# EAGLE design Team 1 board (EAGLE 9.6.2)
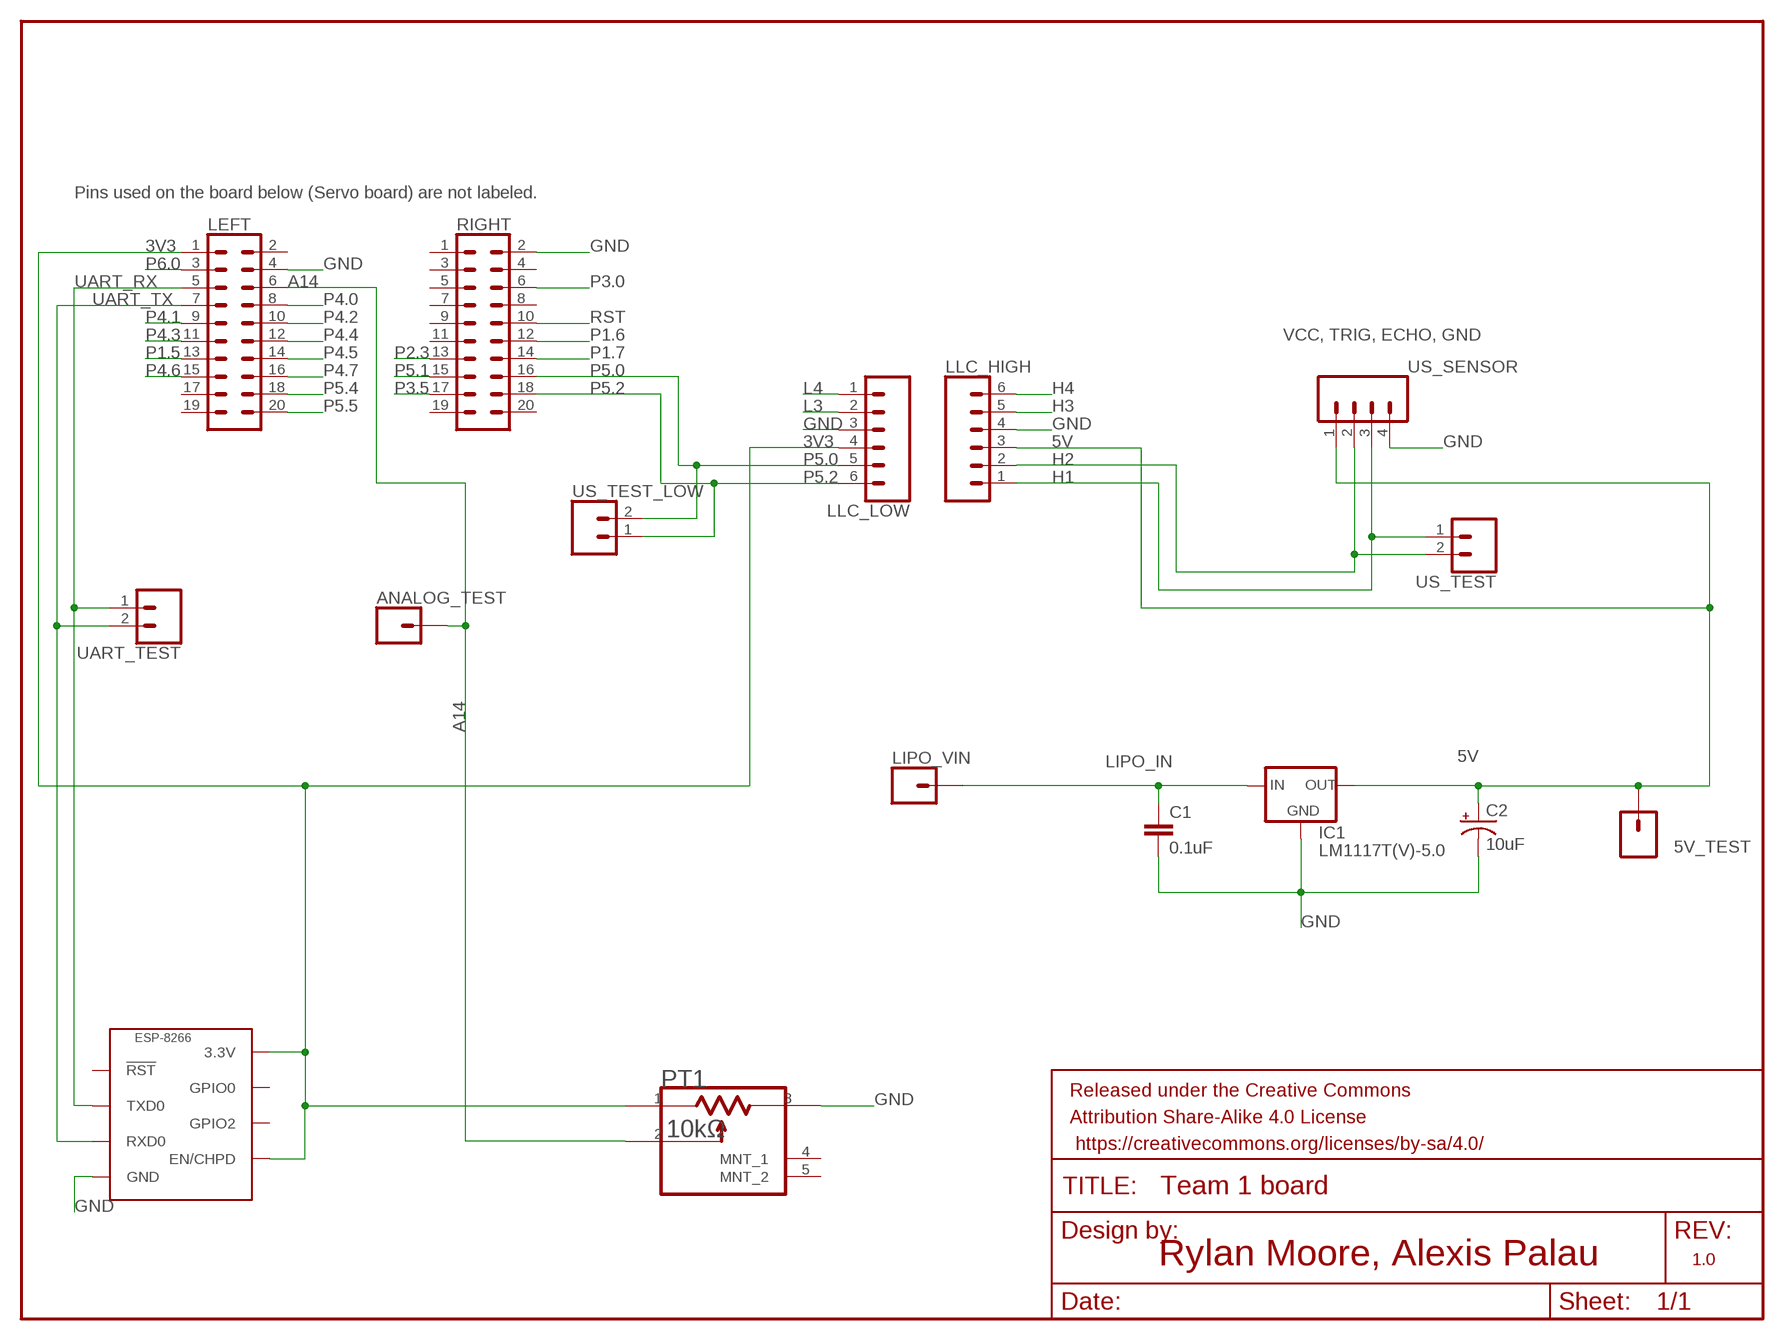
[diagram p0: schematic, sheet 1]

## Parts
5V_TEST  CONN_01  [1X01]
ANALOG_TEST  CONN_01  [1X01]
C1  0.1uF  0.1UF-KIT-EZ-50V-20%  [CAP-PTH-SMALL-KIT]
C2  10uF  10UF-POLAR-RADIAL-2.5MM-25V-20%  [CPOL-RADIAL-2.5MM-5MM]
ESP-8266  ESP8266_ESP-01  [ESP8266_ESP-01_NO-SILKSCREEN]
FRAME1  FRAME-LETTERNO_PACKAGE  [DUMMY]
IC1  LM1117T(V)-5.0  [TO220V]
LEFT  CONN_10X2NOSILK  [2X10_NOSILK]
LIPO_VIN  CONN_01  [1X01]
LLC_HIGH  CONN_06SILK_FEMALE_PTH  [1X06]
LLC_LOW  CONN_06SILK_FEMALE_PTH  [1X06]
PT1  ECG_EVU-F2AF30B14ECG_EVU-F2AF30B14_0_0  [ECG_EVU-F2AF30B14_0]
RIGHT  CONN_10X2NOSILK  [2X10_NOSILK]
UART_TEST  CONN_02  [1X02]
US_SENSOR  CONN_04  [1X04]
US_TEST  CONN_02  [1X02]
US_TEST_LOW  CONN_02  [1X02]

## Nets
3V3: ESP-8266.3V3(3.3V) ESP-8266.EN/CH_PD(EN/CHPD) LEFT.1 LLC_LOW.4 PT1.1
5V: 5V_TEST.1 C2.1(+) IC1.2(OUT) LLC_HIGH.3 US_SENSOR.1
A14: ANALOG_TEST.1 LEFT.6 PT1.2
GND: C1.2 C2.2(-) ESP-8266.GND IC1.1(GND) LEFT.4 LLC_HIGH.4 LLC_LOW.3 PT1.3 RIGHT.2 US_SENSOR.4
H1: LLC_HIGH.1 US_SENSOR.3 US_TEST.1
H2: LLC_HIGH.2 US_SENSOR.2 US_TEST.2
H3: LLC_HIGH.5
H4: LLC_HIGH.6
L3: LLC_LOW.2
L4: LLC_LOW.1
LIPO_IN: C1.1 IC1.3(IN) LIPO_VIN.1
P1.5: LEFT.13
P1.6: RIGHT.12
P1.7: RIGHT.14
P2.3: RIGHT.13
P3.0: RIGHT.6
P3.5: RIGHT.17
P4.0: LEFT.8
P4.1: LEFT.9
P4.2: LEFT.10
P4.3: LEFT.11
P4.4: LEFT.12
P4.5: LEFT.14
P4.6: LEFT.15
P4.7: LEFT.16
P5.0: LLC_LOW.5 RIGHT.16 US_TEST_LOW.2
P5.1: RIGHT.15
P5.2: LLC_LOW.6 RIGHT.18 US_TEST_LOW.1
P5.4: LEFT.18
P5.5: LEFT.20
P6.0: LEFT.3
RST: RIGHT.10
UART_RX: ESP-8266.TX(TXD0) LEFT.5 UART_TEST.1
UART_TX: ESP-8266.RX(RXD0) LEFT.7 UART_TEST.2
Unconnected: ESP-8266.GPIO0 ESP-8266.GPIO2 ESP-8266.RST(!RST!) LEFT.2 LEFT.17 LEFT.19 PT1.4(MNT_1) PT1.5(MNT_2) RIGHT.1 RIGHT.3 RIGHT.4 RIGHT.5 RIGHT.7 RIGHT.8 RIGHT.9 RIGHT.11 RIGHT.19 RIGHT.20

## Notes on the sheet
- Pins used on the board below (Servo board) are not labeled.
- VCC, TRIG, ECHO, GND
- Rylan Moore, Alexis Palau | 1.0

## Library data of the parts
5V_TEST ANALOG_TEST LIPO_VIN = SparkFun-Connectors:CONN_01: Single connection point. Often used as Generic Header-pin footprint for 0.1 inch spaced/style header connections On any of the 0.1 inch spaced packages, you can populate with these: Break Away Headers - Straight <https://www.sparkfun.com/products/116> (PRT-00116) Break Away Male Headers - Right Angle <https://www.sparkfun.com/products/553> (PRT-00553) Female Headers <https://www.sparkfun.com/products/115> (PRT-00115) Break Away Headers - Machine Pin <https://www.sparkfun.com/products/117> (PRT-00117) Break Away Female Headers - Swiss Machine Pin <https://www.sparkfun.com/products/743> (PRT-00743) This device is also useful as a general connection point to wire up your design to another part of your project. Our various solder wires solder well into these plated through hole pads. Hook-Up Wire - Assortment (Stranded, 22 AWG) <https://www.sparkfun.com/products/11375> (PRT-11375) Hook-Up Wire - Assortment (Solid Core, 22 AWG) <https://www.sparkfun.com/products/11367> (PRT-11367) View the entire wire category on our website here <https://www.sparkfun.com/categories/141> Special notes: SMTSO-256-ET is a "flush mount" nut for a 4-40 screw. We mostly use this on specialty testbeds; it is a nice way to connect hardware to your PCB at an adjustable hieght. Also note, the SNAP packages are for using a snappable style connector. We sell a baggie of snaps and they are also used on two LilyPad designs: Snap Assortment - 30 pack (male and female) <https://www.sparkfun.com/products/11347> (DEV-11347) LilyPad Arduino SimpleSnap <https://www.sparkfun.com/products/10941> (DEV-10941) LilyPad SimpleSnap Protoboard <https://www.sparkfun.com/products/10940> (DEV-10940)
C1 = SparkFun-Capacitors:0.1UF: 0.1µF ceramic capacitors A capacitor is a passive two-terminal electrical component used to store electrical energy temporarily in an electric field.; PROD_ID: CAP-08370
C2 = SparkFun-Capacitors:10UF-POLAR: 10.0µF polarized capacitors A capacitor is a passive two-terminal electrical component used to store electrical energy temporarily in an electric field.; PROD_ID: CAP-08440
ESP-8266 = LuisLab-Boards:ESP8266_ESP-?
FRAME1 = SparkFun-Aesthetics:FRAME-LETTER: Schematic Frame - Letter Standard 8.5x11 US Letter frame; DESIGNER: Nobody; VERSION: v01
IC1 = lm1117_10:LM1117?-*: 800mA Low-Dropout Linear Regulator Source: http://www.ti.com/lit/ds/symlink/lm1117-n.pdf; MF: Texas Instruments; MPN: LM1117T-5.0; OC_FARNELL: 1215183; OC_NEWARK: 41K3491
LEFT RIGHT = SparkFun-Connectors:CONN_10X2: Multi connection point. Often used as Generic Header-pin footprint for 0.1 inch spaced/style header connections On any of the 0.1 inch spaced packages, you can populate with these: Break Away Headers - Straight <https://www.sparkfun.com/products/116> (PRT-00116) Break Away Male Headers - Right Angle <https://www.sparkfun.com/products/553> (PRT-00553) Female Headers <https://www.sparkfun.com/products/115> (PRT-00115) Break Away Headers - Machine Pin <https://www.sparkfun.com/products/117> (PRT-00117) Break Away Female Headers - Swiss Machine Pin <https://www.sparkfun.com/products/743> (PRT-00743) Special note about the "SPECIAL" package: This was SPECIALLY designed to be used with our Graphic LCD Backpack. Be sure you want to use this! It is not only staggered on each line of header holes, but IT IS ALSO offset of the center point of the top and bottom lines by 5 mil. This causes the headers to lock into place on the "standard" footprint on the LCD screen. The extra squares on the tdocu layer are there simply to reference other pins (if you were to actually populate a longer header than ten long - this is what we do with the backpacks).
LLC_HIGH LLC_LOW = SparkFun-Connectors:CONN_06: Multi connection point. Often used as Generic Header-pin footprint for 0.1 inch spaced/style header connections On any of the 0.1 inch spaced packages, you can populate with these: Break Away Headers - Straight <https://www.sparkfun.com/products/116> (PRT-00116) Break Away Male Headers - Right Angle <https://www.sparkfun.com/products/553> (PRT-00553) Female Headers <https://www.sparkfun.com/products/115> (PRT-00115) Break Away Headers - Machine Pin <https://www.sparkfun.com/products/117> (PRT-00117) Break Away Female Headers - Swiss Machine Pin <https://www.sparkfun.com/products/743> (PRT-00743) Arduino Stackable Header - 6 Pin <https://www.sparkfun.com/products/9280> (PRT-09280) For SCREWTERMINALS and SPRING TERMINALS visit here: Screw Terimnals on SparkFun.com <https://www.sparkfun.com/search/results?term=Screw+Terminals> (5mm/3.5mm/2.54mm spacing) This device is also useful as a general connection point to wire up your design to another part of your project. Our various solder wires solder well into these plated through hole pads. Hook-Up Wire - Assortment (Stranded, 22 AWG) <https://www.sparkfun.com/products/11375> (PRT-11375) Hook-Up Wire - Assortment (Solid Core, 22 AWG) <https://www.sparkfun.com/products/11367> (PRT-11367) View the entire wire category on our website here <https://www.sparkfun.com/categories/141>; PROD_ID: CONN-08437
PT1 = ECG - EVU-F2AF30B14:ECG_EVU-F2AF30B14: Rotary Potentiometers; CENTROID_NOT_SPECIFIED: No; DATASHEET: https://upverter.com/datasheet/ffe9b4400cd6828c9be88987894b812b9e4368d0.pdf; DIGIKEY_DESCRIPTION: RES 10k Ohm 1 Gang Linear Through Hole, Snap In Potentiometer None 1 Turn 0.05W, 1/20W PC Pins, Board Locks; DIGIKEY_PART_NUMBER: P3C3103-ND; LEAD_FREE: yes; MF: ECG; MOUSER_PART_NUMBER: 667-EVU-F2AF30B14; MPN: EVU-F2AF30B14; PACKAGE: PTH_9MM7_12MM5; PREFIX: R; RESISTANCE: 10kΩ; ROHS: yes
UART_TEST US_TEST US_TEST_LOW = SparkFun-Connectors:CONN_02: Multi connection point. Often used as Generic Header-pin footprint for 0.1 inch spaced/style header connections On any of the 0.1 inch spaced packages, you can populate with these: Break Away Headers - Straight <https://www.sparkfun.com/products/116> (PRT-00116) Break Away Male Headers - Right Angle <https://www.sparkfun.com/products/553> (PRT-00553) Female Headers <https://www.sparkfun.com/products/115> (PRT-00115) Break Away Headers - Machine Pin <https://www.sparkfun.com/products/117> (PRT-00117) Break Away Female Headers - Swiss Machine Pin <https://www.sparkfun.com/products/743> (PRT-00743) For SCREWTERMINALS and SPRING TERMINALS visit here: Screw Terimnals on SparkFun.com <https://www.sparkfun.com/search/results?term=Screw+Terminals> (5mm/3.5mm/2.54mm spacing) This device is also useful as a general connection point to wire up your design to another part of your project. Our various solder wires solder well into these plated through hole pads. Hook-Up Wire - Assortment (Stranded, 22 AWG) <https://www.sparkfun.com/products/11375> (PRT-11375) Hook-Up Wire - Assortment (Solid Core, 22 AWG) <https://www.sparkfun.com/products/11367> (PRT-11367) View the entire wire category on our website here <https://www.sparkfun.com/categories/141> Special notes: Molex polarized connector foot print use with: PRT-08233 with associated crimp pins and housings. 2.54_SCREWTERM for use with PRT-10571. 3.5mm Screw Terminal footprints for PRT-08084 5mm Screw Terminal footprints for use with PRT-08432
US_SENSOR = SparkFun-Connectors:CONN_04: Multi connection point. Often used as Generic Header-pin footprint for 0.1 inch spaced/style header connections On any of the 0.1 inch spaced packages, you can populate with these: Break Away Headers - Straight <https://www.sparkfun.com/products/116> (PRT-00116) Break Away Male Headers - Right Angle <https://www.sparkfun.com/products/553> (PRT-00553) Female Headers <https://www.sparkfun.com/products/115> (PRT-00115) Break Away Headers - Machine Pin <https://www.sparkfun.com/products/117> (PRT-00117) Break Away Female Headers - Swiss Machine Pin <https://www.sparkfun.com/products/743> (PRT-00743) For SCREWTERMINALS and SPRING TERMINALS visit here: Screw Terimnals on SparkFun.com <https://www.sparkfun.com/search/results?term=Screw+Terminals> (5mm/3.5mm/2.54mm spacing) This device is also useful as a general connection point to wire up your design to another part of your project. Our various solder wires solder well into these plated through hole pads. Hook-Up Wire - Assortment (Stranded, 22 AWG) <https://www.sparkfun.com/products/11375> (PRT-11375) Hook-Up Wire - Assortment (Solid Core, 22 AWG) <https://www.sparkfun.com/products/11367> (PRT-11367) View the entire wire category on our website here <https://www.sparkfun.com/categories/141> Special notes: Molex polarized connector foot print use with SKU : PRT-08231 with associated crimp pins and housings. 1MM SMD Version SKU: PRT-10208; PROD_ID: CONN-09696

## Board
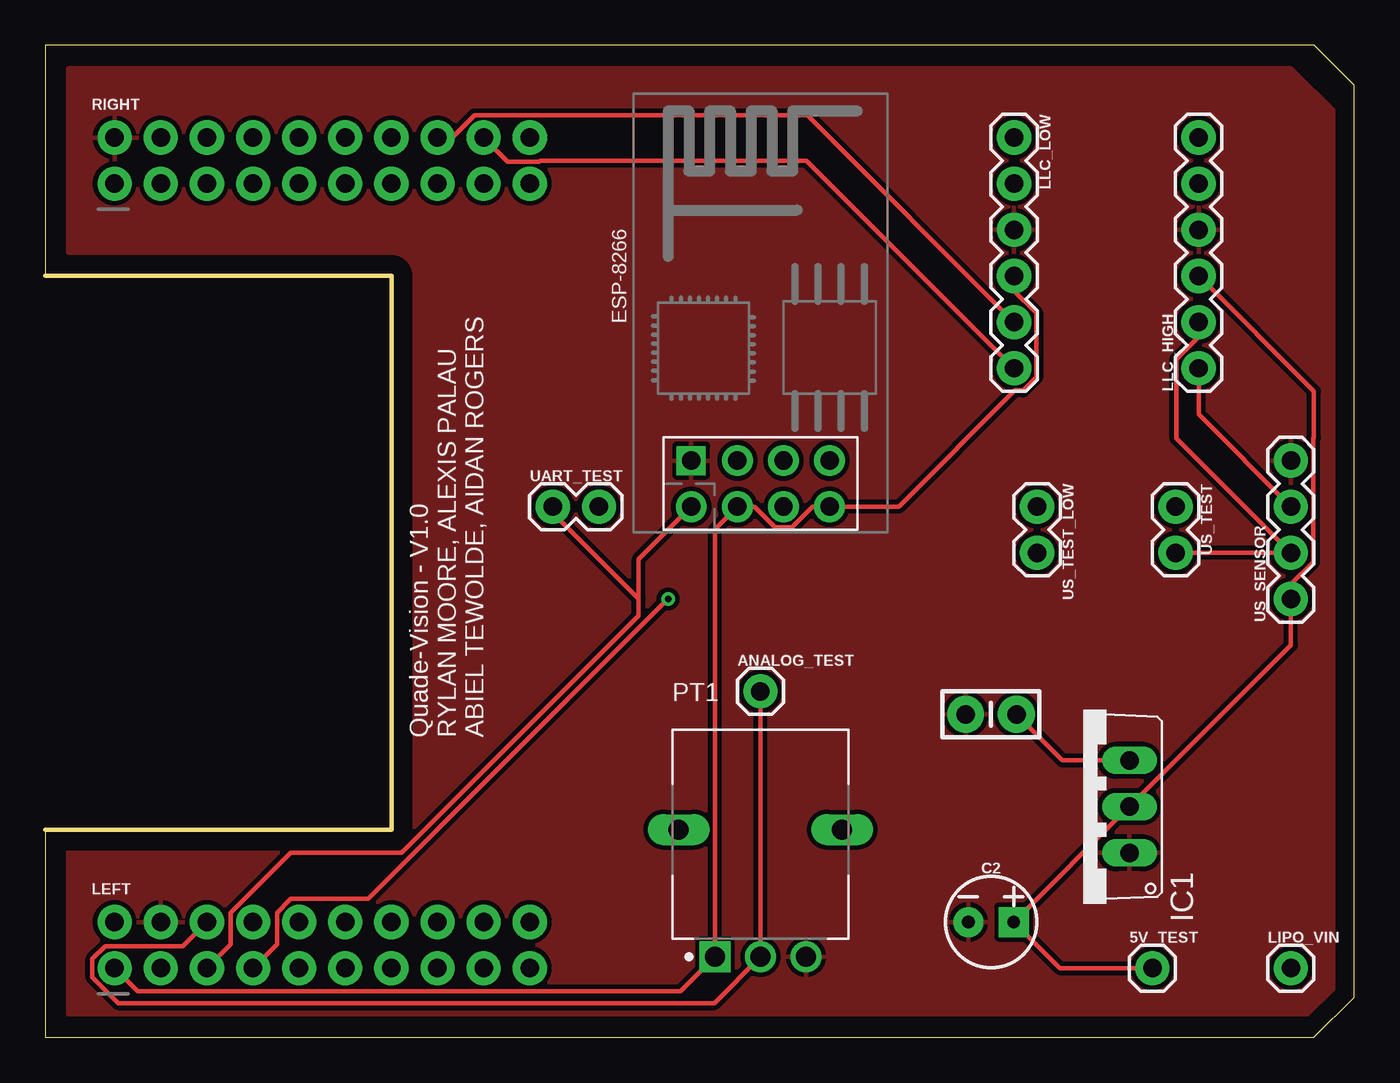
[diagram p1: board, top side]
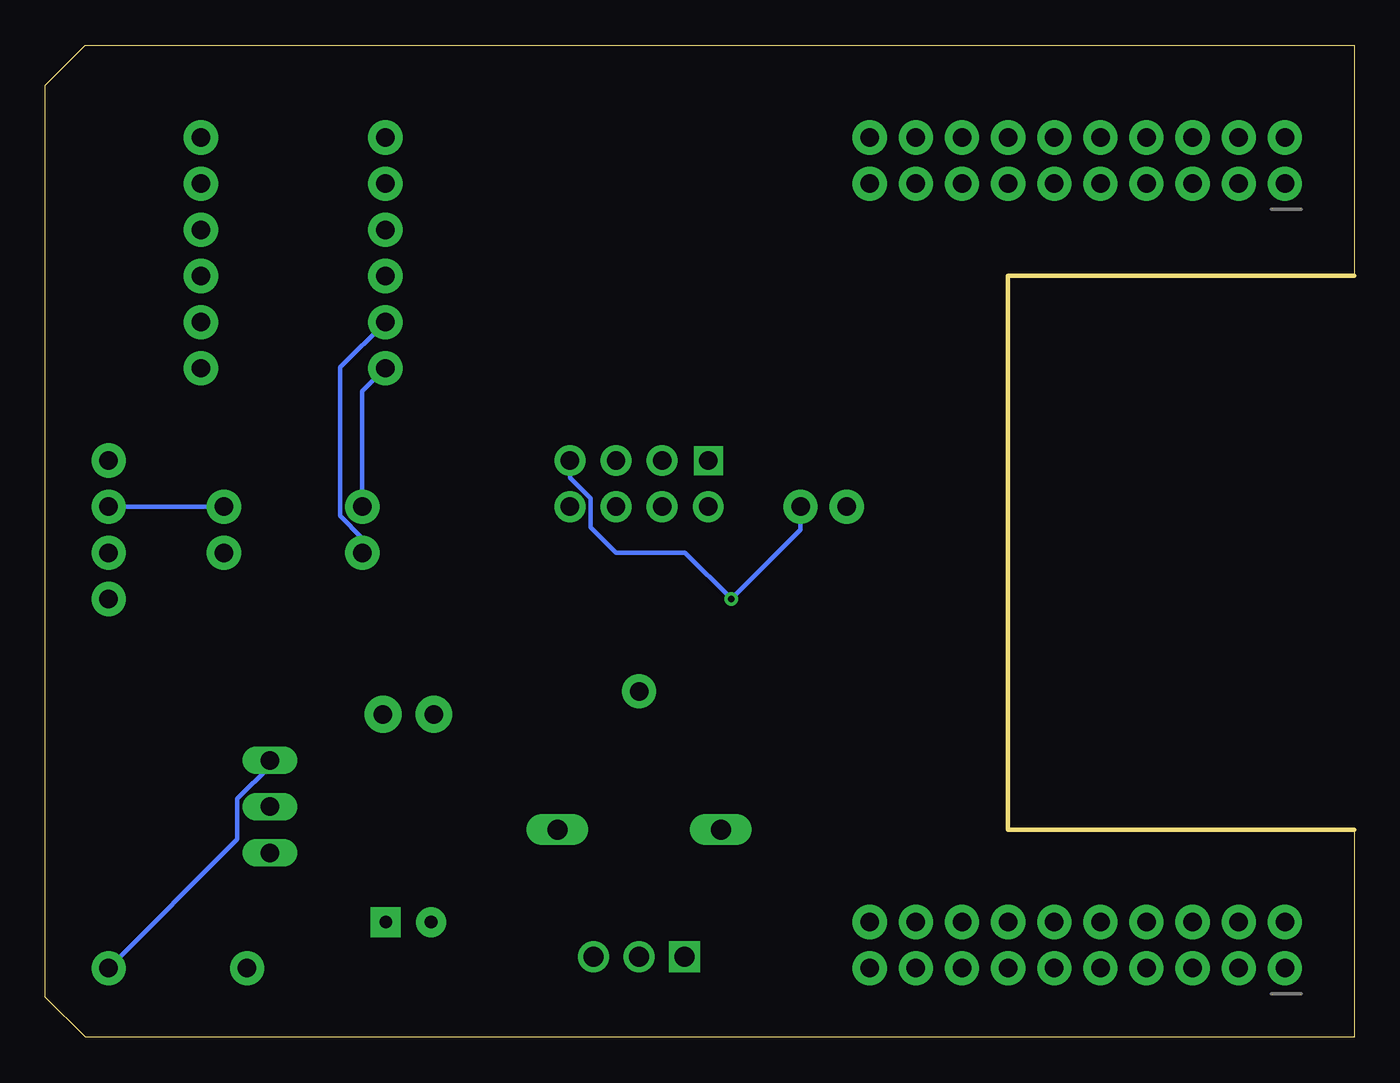
[diagram p2: board, bottom side, seen from below]

Size 72.06 x 54.6 mm. Coordinates in mm from the lower left corner, seen from the top.
Outline: 0,0 69.85,0 72.06,2.21 72.06,52.4 69.86,54.6 0,54.6 0,41.91 19.05,41.91 19.05,11.43 0,11.43 0,0
Copper layers (1*16): Top 0.035mm / dielectric 1.5mm / Bottom 0.035mm
Design rules "default *": minimum track width 10mil, minimum drill 0.35mm, track to track 10mil, track to pad 6mil, pad to pad 10mil, via to via 10mil, smd to smd 6mil, copper to edge 40mil, drill to drill 6mil, minimum pad ring 10mil, minimum via ring 8mil, stop-mask expansion 4mil, vias tented up to drill 0mil, thermal gap 10mil

### Footprints (pad centres in the part's own frame; a part is rotated, then mirrored left to right if it is on the bottom)
1X01 = drill 1.016 pad 1.88: 1 0,0
CAP-PTH-SMALL-KIT = drill 1.016 pad 2.032: 1 -1.397,0; 2 1.397,0
CPOL-RADIAL-2.5MM-5MM = drill 0.7 pad 1.651 square: 1 1.25,0 | drill 0.7 pad 1.651: 2 -1.25,0
ESP8266_ESP-01_NO-SILKSCREEN = drill 1.016 pad 1.7: 3V3 -1.27,-3.81; EN/CH_PD -1.27,1.27; GPIO0 1.27,-1.27; GPIO2 1.27,1.27; RST -1.27,-1.27; RX 1.27,-3.81; TX -1.27,3.81 | drill 1.016 pad 1.6 square: GND 1.27,3.81
TO220V = drill 1.016 long: 1 -2.54,-2.54; 2 0,-2.54; 3 2.54,-2.54
2X10_NOSILK = drill 1.016 pad 1.88: 1 0,0; 2 0,2.54; 3 2.54,0; 4 2.54,2.54; 5 5.08,0; 6 5.08,2.54; 7 7.62,0; 8 7.62,2.54; 9 10.16,0; 10 10.16,2.54; 11 12.7,0; 12 12.7,2.54; 13 15.24,0; 14 15.24,2.54; 15 17.78,0; 16 17.78,2.54; 17 20.32,0; 18 20.32,2.54; 19 22.86,0; 20 22.86,2.54
1X06 = drill 1.016 pad 1.88: 1 0,0; 2 2.54,0; 3 5.08,0; 4 7.62,0; 5 10.16,0; 6 12.7,0
ECG_EVU-F2AF30B14_0 = drill 1.1 pad 1.7 square: 1 -2.5,-7 | drill 1.1 pad 1.7: 2 0,-7; 3 2.5,-7 | drill 1.1 pad 1.7 long: 4 -4.5,0; 5 4.5,0
1X02 = drill 1.016 pad 1.88: 1 0,0; 2 2.54,0
1X04 = drill 1.016 pad 1.88: 1 0,0; 2 2.54,0; 3 5.08,0; 4 7.62,0

### Placement (x,y rotation side)
5V_TEST  60.96,3.81 0 top
ANALOG_TEST  39.37,19.05 0 top
C1  52.07,17.78 180 top
C2  52.07,6.35 0 top
ESP-8266  39.37,30.48 90 top
FRAME1  0,0 0 top
IC1  57.15,12.7 90 top
LEFT  3.81,3.81 0 top
LIPO_VIN  68.58,3.81 0 top
LLC_HIGH  63.5,36.83 90 top
LLC_LOW  53.34,49.53 270 top
PT1  39.37,11.43 0 top
RIGHT  3.81,46.99 0 top
UART_TEST  27.94,29.21 0 top
US_SENSOR  68.58,24.13 90 top
US_TEST  62.23,29.21 270 top
US_TEST_LOW  54.61,29.21 270 top

### Tracks (layer width: path | path; a pad name or v marks a point on that pad's centre or on a via)
3V3
  Top 0.254: LEFT.1 5.08,2.54 34.98,2.54 PT1.1 36.87,27.98 ESP-8266.EN/CH_PD 39.04,29.21 40.17,28.08 41.11,28.08 42.24,29.21 ESP-8266.3V3 46.99,29.21 53.39,35.61 53.84,35.61 54.56,36.33 54.56,39.88 53.34,41.09 LLC_LOW.4
5V
  Top 0.254: LLC_HIGH.3 69.85,35.56 69.85,33.02 69.8,32.97 69.8,26.16 68.58,24.95 US_SENSOR.1 68.58,21.59 IC1.2 59.67,12.7 C2.1 55.86,3.81 5V_TEST.1
A14
  Top 0.254: LEFT.6 7.57,5.03 3.31,5.03 2.59,4.32 2.59,3.31 4.01,1.89 36.83,1.89 PT1.2 ANALOG_TEST.1
GND
  Top 0.254: 50.8,17.65 C1.2 50.81,17.64
  pour Top: 1.27,53.34 68.58,53.34 71.12,50.8 71.12,2.54 69.85,1.27 1.27,1.27 1.27,11.43 19.05,11.43 19.05,43.18 1.27,43.18
H1
  Top 0.254: LLC_HIGH.1 63.5,34.29 US_SENSOR.3
  Bottom 0.254: US_SENSOR.3 US_TEST.1
H2
  Top 0.254: LLC_HIGH.2 63.5,38.55 62.28,37.34 62.28,32.97 US_SENSOR.2 US_TEST.2
LIPO_IN
  Top 0.254: C1.1 56.01,15.24 IC1.3
  Bottom 0.254: LIPO_VIN.1 61.49,10.9 61.49,13.13 59.69,14.94 IC1.3
P5.0
  Top 0.254: RIGHT.16 22.41,49.53 23.62,50.75 41.96,50.75 LLC_LOW.5
  Bottom 0.254: US_TEST_LOW.2 54.61,27.49 55.83,28.7 55.83,36.88 LLC_LOW.5
P5.2
  Top 0.254: RIGHT.18 25.45,48.21 27.18,48.21 27.23,48.26 41.91,48.26 LLC_LOW.6
  Bottom 0.254: LLC_LOW.6 54.61,35.56 US_TEST_LOW.1
UART_RX
  Top 0.254: LEFT.5 10.21,5.13 10.21,6.86 13.52,10.16 19.6,10.16 32.66,23.22 32.66,24.13 | 32.66,24.13 32.66,26.31 ESP-8266.TX | 32.66,24.13 27.94,28.85 UART_TEST.1
UART_TX  (via drill 0.35)
  Top 0.254: LEFT.7 12.75,5.13 12.75,6.86 13.52,7.62 17.78,7.62 v34.29,24.13
  Bottom 0.254: ESP-8266.RX 43.18,30.81 42.05,29.68 42.05,28.08 40.64,26.67 36.83,26.67 v34.29,24.13 30.48,27.94 UART_TEST.2

### Text on the board
tNames: Quade-Vision - V1.0 / RYLAN MOORE, ALEXIS PALAU / ABIEL TEWOLDE, AIDAN ROGERS